# Altium schematic sheet MotorController.SchDoc
size A4
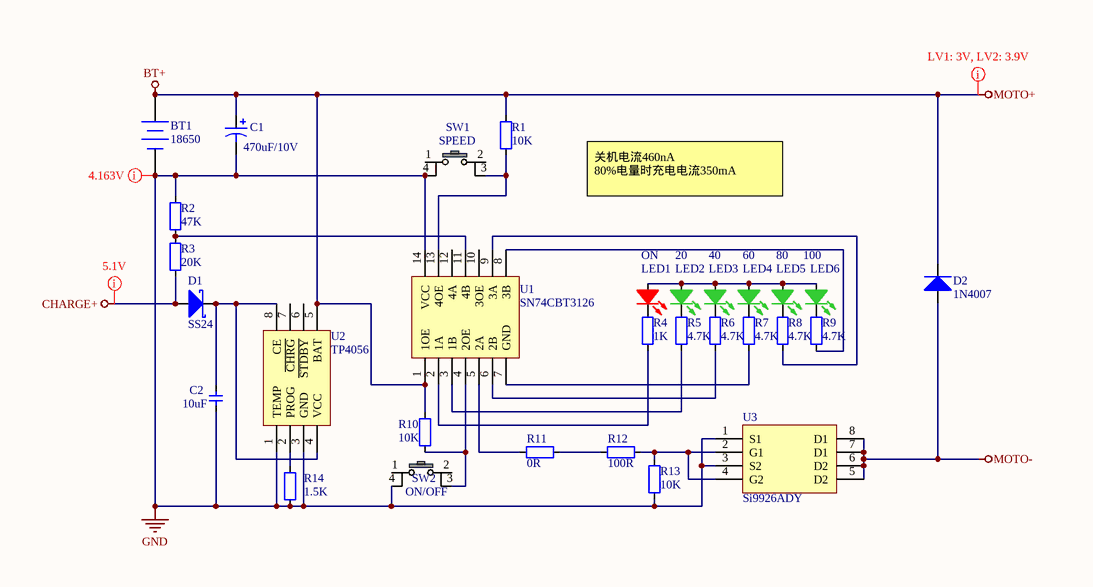
[diagram p0: MotorController.SchDoc]

## Parts
BT1  18650  [BAT-2]
C1  470uF/10V  [RB7.6-15]
C2  10uF  [CAP_1206]
D1  SS24  [DO-214AC]
D2  1N4007  [SOD123]
LED1  ON  [LED_0603_RED]
LED2  20  [LED_0603_GREEN]
LED3  40  [LED_0603_GREEN]
LED4  60  [LED_0603_GREEN]
LED5  80  [LED_0603_GREEN]
LED6  100  [LED_0603_GREEN]
R1  10K  [RES_0603]
R2  47K  [RES_0805]
R3  20K  [RES_0805]
R4  1K  [RES_0603]
R5  4.7K  [RES_0603]
R6  4.7K  [RES_0603]
R7  4.7K  [RES_0603]
R8  4.7K  [RES_0603]
R9  4.7K  [RES_0603]
R10  10K  [RES_0603]
R11  0R  [RES_0603]
R12  100R  [RES_0603]
R13  10K  [RES_0603]
R14  1.5K  [RES_0603]
SW1  SPEED  [SWITCH_SMD]
SW2  ON/OFF  [SWITCH_SMD]
U1  SN74CBT3126  [SN74CBT3126PWR]
U2  TP4056  [SOIC_8]
U3  Si9926ADY  [SOIC_8]

## Nets
BT+: BT1.1(+) C1.1 D2.2(K) R1.2 R10.1 U1.1(1OE) U2.5(BAT)  [also labelled MOTO+]
CHARGE+: D1.1(A) R3.1
GND: BT1.2(-) C1.2 C2.1 R2.2 R13.2 R14.2 SW1.4 SW2.4 U1.14(VCC) U2.1(TEMP) U2.3(GND) U3.1(S1) U3.3(S2)
MOTO-: D2.1(A) U3.5(D2) U3.6(D2) U3.7(D1) U3.8(D1)
NetC2_2: C2.2 D1.2(K) U2.4(VCC) U2.8(CE)
NetLED1_1: LED1.1(A) LED2.1(A) LED3.1(A) LED4.1(A) LED5.1(A) LED6.1(A)
NetLED1_2: LED1.2(K) R4.1
NetLED2_2: LED2.2(K) R5.1
NetLED3_2: LED3.2(K) R6.1
NetLED4_2: LED4.2(K) R7.1
NetLED5_2: LED5.2(K) R8.1
NetLED6_2: LED6.2(K) R9.1
NetR1_1: R1.1 SW1.3 U1.13(4OE)
NetR2_1: R2.1 R3.2 U1.11(4B)
NetR4_2: R4.2 U1.2(1A)
NetR5_2: R5.2 U1.3(1B)
NetR6_2: R6.2 U1.6(2B)
NetR7_2: R7.2 U1.7(GND)
NetR8_2: R8.2 U1.9(3A)
NetR9_2: R9.2 U1.8(3B)
NetR10_2: R10.2 SW2.3 U1.4(2OE)
NetR11_1: R11.1 U1.5(2A)
NetR11_2: R11.2 R12.1
NetR12_2: R12.2 R13.1 U3.2(G1) U3.4(G2)
NetR14_1: R14.1 U2.2(PROG)

Not connected (* = marked no-connect by the designer): SW1 1 2; SW2 1 2; U1 10(3OE) 12(4A); U2 6(~{STDBY}) 7(~{CHRG})

## Layout directives
mark named 4.163V: GND
mark named 5.1V: CHARGE+
mark named LV1: 3V, LV2: 3.9V: BT+

## Notes on the sheet
- 关机电流460nA
  80%电量时充电电流350mA

## Library data of the parts
BT1 = Battery: Multicell Battery; Published: 24-Mar-1999; LatestRevisionDate: 17-Jul-2002; LatestRevisionNote: Re-released for DXP Platform.; PackageReference: BAT-2; Publisher: Altium Limited; PackageDescription: Battery; 2 Leads
C1 = Cap Pol1: Polarized Capacitor (Radial); Value: 100pF; Published: 8-Jun-2000; LatestRevisionDate: 17-Jul-2002; LatestRevisionNote: Re-released for DXP Platform.; PackageReference: RB7.6-15; Publisher: Altium Limited; PackageDescription: Polarized Capacitor (Radial); 2 Leads
C2 = Cap_1206: Capacitor; Value: ?F
D1 = Diode_Schottky: Diode
D2 = Diode_SOD323: Diode; SOD323: 1N?
LED1 = LED_0603_RED: LED
LED2-LED6 = LED_0603_GREEN: LED
R1 R4-R14 = Res_0603: Resistor; Value: ?K
R2 R3 = Res_0805: Resistor; Value: ?K
SW1 SW2 = SWITCH: 6*6
U1 = SN74CBT3126: 74 Series
U2 = TP4056: Li-lon Battery Charger
U3 = SI9926: Dual N-Channel P ower MOSFET